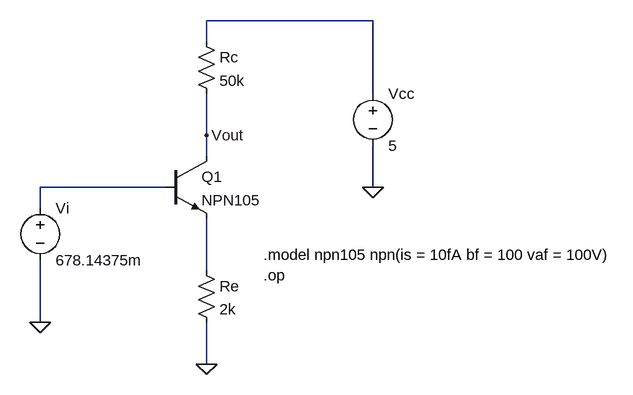
[diagram p0: schematic Draft10.asc]
Draft10.asc, the LTspice schematic file:
Version 4
SHEET 1 880 680
WIRE 432 32 176 32
WIRE 176 64 176 32
WIRE 432 144 432 32
WIRE 176 208 176 144
WIRE 176 240 176 208
WIRE 112 288 -80 288
WIRE 432 288 432 224
WIRE -80 320 -80 288
WIRE 176 416 176 336
WIRE -80 496 -80 400
WIRE 176 560 176 496
FLAG -80 496 0
FLAG 176 560 0
FLAG 432 288 0
FLAG 176 208 Vout
SYMBOL npn 112 240 R0
SYMATTR InstName Q1
SYMATTR Value NPN105
SYMBOL res 160 48 R0
SYMATTR InstName Rc
SYMATTR Value 50k
SYMBOL res 160 400 R0
SYMATTR InstName Re
SYMATTR Value 2k
SYMBOL voltage -80 304 R0
SYMATTR InstName Vi
SYMATTR Value 678.14375m
SYMBOL voltage 432 128 R0
SYMATTR InstName Vcc
SYMATTR Value 5
TEXT 264 392 Left 2 !.model npn105 npn(is = 10fA bf = 100 vaf = 100V)\n.op

The netlist it stands for:
* Draft10.asc
Q1 Vout N002 N003 0 NPN105
Rc N001 Vout 50k
Re N003 0 2k
Vi N002 0 678.14375m
Vcc N001 0 5
.model NPN NPN
.model PNP PNP
.lib standard.bjt
.model npn105 npn(is = 10fA bf = 100 vaf = 100V)
.op
.backanno
.end